# EAGLE schematic Hacked_Body_Scale_v_1 (EAGLE 6.4)
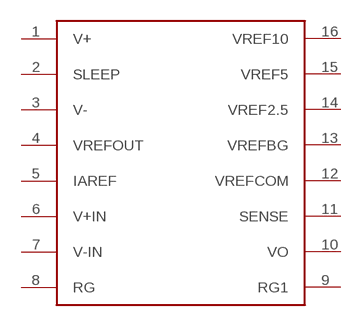
[diagram p0: schematic, sheet 1]

## Parts
U$1  INA125P  [DIL16]
Unconnected: U$1.1(V+) U$1.2(SLEEP) U$1.3(V-) U$1.4(VREFOUT) U$1.5(IAREF) U$1.6(V+IN) U$1.7(V-IN) U$1.8(RG) U$1.9(RG1) U$1.10(VO) U$1.11(SENSE) U$1.12(VREFCOM) U$1.13(VREFBG) U$1.14(VREF2.5) U$1.15(VREF5) U$1.16(VREF10)

## Library data of the parts
U$1 = SparkFun:INA125P